# EAGLE design jointio (EAGLE 4.16)
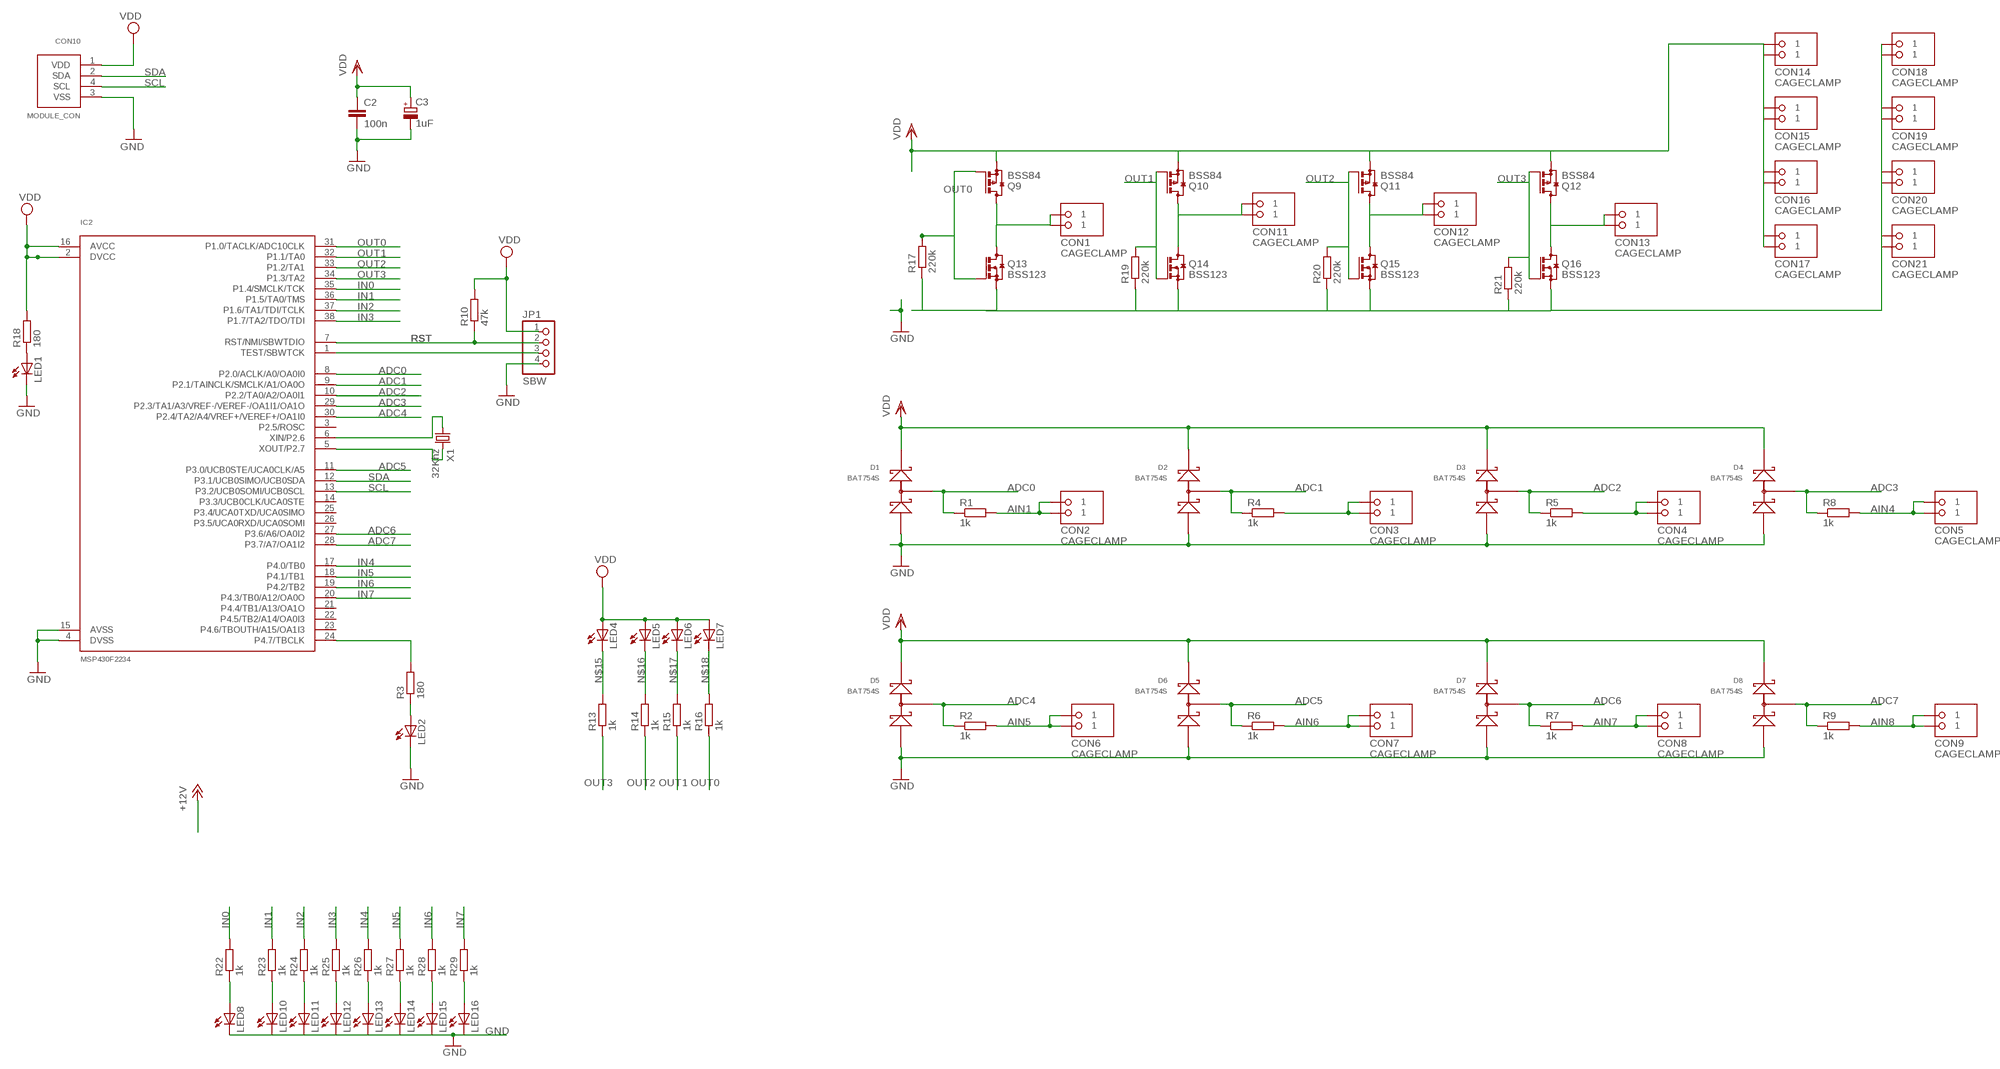
[diagram p0: schematic, sheet 1]

## Parts
C2  100n  C-EUC0603  [C0603]
C3  1uF  CPOL-EUB45181A  [B45181A]
CON1  CAGECLAMP  [CAGECLAMP]
CON2  CAGECLAMP  [CAGECLAMP]
CON3  CAGECLAMP  [CAGECLAMP]
CON4  CAGECLAMP  [CAGECLAMP]
CON5  CAGECLAMP  [CAGECLAMP]
CON6  CAGECLAMP  [CAGECLAMP]
CON7  CAGECLAMP  [CAGECLAMP]
CON8  CAGECLAMP  [CAGECLAMP]
CON9  CAGECLAMP  [CAGECLAMP]
CON10  MODULE_CON  [RJ11-4P4C]
CON11  CAGECLAMP  [CAGECLAMP]
CON12  CAGECLAMP  [CAGECLAMP]
CON13  CAGECLAMP  [CAGECLAMP]
CON14  CAGECLAMP  [CAGECLAMP]
CON15  CAGECLAMP  [CAGECLAMP]
CON16  CAGECLAMP  [CAGECLAMP]
CON17  CAGECLAMP  [CAGECLAMP]
CON18  CAGECLAMP  [CAGECLAMP]
CON19  CAGECLAMP  [CAGECLAMP]
CON20  CAGECLAMP  [CAGECLAMP]
CON21  CAGECLAMP  [CAGECLAMP]
D1  BAT754S  [SOT23]
D2  BAT754S  [SOT23]
D3  BAT754S  [SOT23]
D4  BAT754S  [SOT23]
D5  BAT754S  [SOT23]
D6  BAT754S  [SOT23]
D7  BAT754S  [SOT23]
D8  BAT754S  [SOT23]
IC2  MSP430F2234  [TSSOP38]
JP1  SBW  PINHD-1X4  [1X04]
LED1  LEDCHIP-LED0603  [CHIP-LED0603]
LED2  LEDCHIP-LED0603  [CHIP-LED0603]
LED4  LEDCHIP-LED0603  [CHIP-LED0603]
LED5  LEDCHIP-LED0603  [CHIP-LED0603]
LED6  LEDCHIP-LED0603  [CHIP-LED0603]
LED7  LEDCHIP-LED0603  [CHIP-LED0603]
LED8  LEDCHIP-LED0603  [CHIP-LED0603]
LED10  LEDCHIP-LED0603  [CHIP-LED0603]
LED11  LEDCHIP-LED0603  [CHIP-LED0603]
LED12  LEDCHIP-LED0603  [CHIP-LED0603]
LED13  LEDCHIP-LED0603  [CHIP-LED0603]
LED14  LEDCHIP-LED0603  [CHIP-LED0603]
LED15  LEDCHIP-LED0603  [CHIP-LED0603]
LED16  LEDCHIP-LED0603  [CHIP-LED0603]
Q9  BSS84  [SOT23]
Q10  BSS84  [SOT23]
Q11  BSS84  [SOT23]
Q12  BSS84  [SOT23]
Q13  BSS123  [SOT23]
Q14  BSS123  [SOT23]
Q15  BSS123  [SOT23]
Q16  BSS123  [SOT23]
R1  1k  R-EU_R0603  [R0603]
R2  1k  R-EU_R0603  [R0603]
R3  180  R-EU_R0603  [R0603]
R4  1k  R-EU_R0603  [R0603]
R5  1k  R-EU_R0603  [R0603]
R6  1k  R-EU_R0603  [R0603]
R7  1k  R-EU_R0603  [R0603]
R8  1k  R-EU_R0603  [R0603]
R9  1k  R-EU_R0603  [R0603]
R10  47k  R-EU_R0603  [R0603]
R13  1k  R-EU_R0603  [R0603]
R14  1k  R-EU_R0603  [R0603]
R15  1k  R-EU_R0603  [R0603]
R16  1k  R-EU_R0603  [R0603]
R17  220k  R-EU_R0603  [R0603]
R18  180  R-EU_R0603  [R0603]
R19  220k  R-EU_R0603  [R0603]
R20  220k  R-EU_R0603  [R0603]
R21  220k  R-EU_R0603  [R0603]
R22  1k  R-EU_R0603  [R0603]
R23  1k  R-EU_R0603  [R0603]
R24  1k  R-EU_R0603  [R0603]
R25  1k  R-EU_R0603  [R0603]
R26  1k  R-EU_R0603  [R0603]
R27  1k  R-EU_R0603  [R0603]
R28  1k  R-EU_R0603  [R0603]
R29  1k  R-EU_R0603  [R0603]
X1  32Khz  CRYSTALTC26H  [TC26H]

## Nets
ADC0: D1.3(MID) IC2.8(P2.0/ACLK/A0/OA0I0) R1.1
ADC1: D2.3(MID) IC2.9(P2.1/TAINCLK/SMCLK/A1/OA0O) R4.1
ADC2: D3.3(MID) IC2.10(P2.2/TA0/A2/OA0I1) R5.1
ADC3: D4.3(MID) IC2.29(P2.3/TA1/A3/VREF-/VEREF-/OA1I1/OA1O) R8.1
ADC4: D5.3(MID) IC2.30(P2.4/TA2/A4/VREF+/VEREF+/OA1I0) R2.1
ADC5: D6.3(MID) IC2.11(P3.0/UCB0STE/UCA0CLK/A5) R6.1
ADC6: D7.3(MID) IC2.27(P3.6/A6/OA0I2) R7.1
ADC7: D8.3(MID) IC2.28(P3.7/A7/OA1I2) R9.1
AIN1: CON2.1 CON2.2 R1.2
AIN4: CON5.1 CON5.2 R8.2
AIN5: CON6.1 CON6.2 R2.2
AIN6: CON7.1 CON7.2 R6.2
AIN7: CON8.1 CON8.2 R7.2
AIN8: CON9.1 CON9.2 R9.2
GND: C2.2 C3.- CON10.3(VSS) CON18.1 CON18.2 CON19.1 CON19.2 CON20.1 CON20.2 CON21.1 CON21.2 D1.1(ANODE) D2.1(ANODE) D3.1(ANODE) D4.1(ANODE) D5.1(ANODE) D6.1(ANODE) D7.1(ANODE) D8.1(ANODE) IC2.4(DVSS) IC2.15(AVSS) JP1.4 LED1.C LED2.C LED8.C LED10.C LED11.C LED12.C LED13.C LED14.C LED15.C LED16.C Q13.2(S) Q14.2(S) Q15.2(S) Q16.2(S) R17.1 R19.1 R20.1 R21.1
IN0: IC2.35(P1.4/SMCLK/TCK) R22.2
IN1: IC2.36(P1.5/TA0/TMS) R23.2
IN2: IC2.37(P1.6/TA1/TDI/TCLK) R24.2
IN3: IC2.38(P1.7/TA2/TDO/TDI) R25.2
IN4: IC2.17(P4.0/TB0) R26.2
IN5: IC2.18(P4.1/TB1) R27.2
IN6: IC2.19(P4.2/TB2) R28.2
IN7: IC2.20(P4.3/TB0/A12/OA0O) R29.2
N$1: CON3.1 CON3.2 R4.2
N$2: CON11.1 CON11.2 Q10.3(D) Q14.3(D)
N$3: CON4.1 CON4.2 R5.2
N$4: IC2.6(XIN/P2.6) X1.1
N$5: IC2.24(P4.7/TBCLK) R3.2
N$6: LED1.A R18.1
N$7: CON1.1 CON1.2 Q9.3(D) Q13.3(D)
N$8: LED2.A R3.1
N$9: CON12.1 CON12.2 Q11.3(D) Q15.3(D)
N$10: IC2.1(TEST/SBWTCK) JP1.3
N$12: CON13.1 CON13.2 Q12.3(D) Q16.3(D)
N$15: LED4.C R13.2
N$16: LED5.C R14.2
N$17: LED6.C R15.2
N$18: LED7.C R16.2
N$19: IC2.5(XOUT/P2.7) X1.2
N$21: LED8.A R22.1
N$22: LED10.A R23.1
N$23: LED11.A R24.1
N$24: LED12.A R25.1
N$25: LED13.A R26.1
N$26: LED14.A R27.1
N$27: LED15.A R28.1
N$28: LED16.A R29.1
OUT0: IC2.31(P1.0/TACLK/ADC10CLK) Q9.1(G) Q13.1(G) R16.1 R17.2
OUT1: IC2.32(P1.1/TA0) Q10.1(G) Q14.1(G) R15.1 R19.2
OUT2: IC2.33(P1.2/TA1) Q11.1(G) Q15.1(G) R14.1 R20.2
OUT3: IC2.34(P1.3/TA2) Q12.1(G) Q16.1(G) R13.1 R21.2
RST: IC2.7(RST/NMI/SBWTDIO) JP1.2 R10.1
SCL: CON10.4(SCL) IC2.13(P3.2/UCB0SOMI/UCB0SCL)
SDA: CON10.2(SDA) IC2.12(P3.1/UCB0SIMO/UCB0SDA)
VDD: C2.1 C3.+ CON10.1(VDD) CON14.1 CON14.2 CON15.1 CON15.2 CON16.1 CON16.2 CON17.1 CON17.2 D1.2(CATHODE) D2.2(CATHODE) D3.2(CATHODE) D4.2(CATHODE) D5.2(CATHODE) D6.2(CATHODE) D7.2(CATHODE) D8.2(CATHODE) IC2.2(DVCC) IC2.16(AVCC) JP1.1 LED4.A LED5.A LED6.A LED7.A Q9.2(S) Q10.2(S) Q11.2(S) Q12.2(S) R10.2 R18.2
Unconnected: IC2.3(P2.5/ROSC) IC2.14(P3.3/UCB0CLK/UCA0STE) IC2.21(P4.4/TB1/A13/OA1O) IC2.22(P4.5/TB2/A14/OA0I3) IC2.23(P4.6/TBOUTH/A15/OA1I3) IC2.25(P3.4/UCA0TXD/UCA0SIMO) IC2.26(P3.5/UCA0RXD/UCA0SOMI)

## Library data of the parts
C2 = rcl:C-EU: CAPACITOR, European symbol
C3 = rcl:CPOL-EU: POLARIZED CAPACITOR, European symbol
CON1-CON9 CON11-CON21 = ecssr:CAGECLAMP
CON10 = ecssr:MODULE_CON
D1-D8 = ecssr:BAT754S
IC2 = ecssr:MSP430F2234
JP1 = pinhead:PINHD-1X4: PIN HEADER
LED1 LED2 LED4-LED8 LED10-LED16 = led:LED: LED OSRAM: - CHIPLED LG R971, LG N971, LY N971, LG Q971, LY Q971, LO R971, LY R971 LH N974, LH R974 LS Q976, LO Q976, LY Q976 LO Q996 - Hyper CHIPLED LW Q18S LB Q993, LB Q99A, LB R99A - SideLED LS A670, LO A670, LY A670, LG A670, LP A670 LB A673, LV A673, LT A673, LW A673 LH A674 LY A675 LS A676, LA A676, LO A676, LY A676, LW A676 LS A679, LY A679, LG A679 - Hyper Micro SIDELED® LS Y876, LA Y876, LO Y876, LY Y876 LT Y87S - SmartLED LW L88C, LW L88S LB L89C, LB L89S, LG L890 LS L89K, LO L89K, LY L89K LS L896, LA L896, LO L896, LY L896 - TOPLED LS T670, LO T670, LY T670, LG T670, LP T670 LSG T670, LSP T670, LSY T670, LOP T670, LYG T670 LG T671, LOG T671, LSG T671 LB T673, LV T673, LT T673, LW T673 LH T674 LS T676, LA T676, LO T676, LY T676, LB T676, LH T676, LSB T676, LW T676 LB T67C, LV T67C, LT T67C, LS T67K, LO T67K, LY T67K, LW E67C LS E67B, LA E67B, LO E67B, LY E67B, LB E67C, LV E67C, LT E67C LW T67C LS T679, LY T679, LG T679 LS T770, LO T770, LY T770, LG T770, LP T770 LB T773, LV T773, LT T773, LW T773 LH T774 LS E675, LA E675, LY E675, LS T675 LS T776, LA T776, LO T776, LY T776, LB T776 LHGB T686 LT T68C, LB T68C - Hyper Mini TOPLED® LB M676 - Mini TOPLED Santana® LG M470 LS M47K, LO M47K, LY M47K Source: http://www.osram.convergy.de - LUMILED® LXK2-PW12-R00, LXK2-PW12-S00, LXK2-PW14-U00, LXK2-PW14-V00 LXK2-PM12-R00, LXK2-PM12-S00, LXK2-PM14-U00 LXK2-PE12-Q00, LXK2-PE12-R00, LXK2-PE12-S00, LXK2-PE14-T00, LXK2-PE14-U00 LXK2-PB12-K00, LXK2-PB12-L00, LXK2-PB12-M00, LXK2-PB14-N00, LXK2-PB14-P00, LXK2-PB14-Q00 LXK2-PR12-L00, LXK2-PR12-M00, LXK2-PR14-Q00, LXK2-PR14-R00 LXK2-PD12-Q00, LXK2-PD12-R00, LXK2-PD12-S00 LXK2-PH12-R00, LXK2-PH12-S00 LXK2-PL12-P00, LXK2-PL12-Q00, LXK2-PL12-R00 Source: www.luxeon.com
Q9-Q12 = transistor-small-signal:BSS84: P-CHANNEL MOS FET
Q13-Q16 = transistor-small-signal:BSS123: N-CHANNEL MOS FET
R1-R10 R13-R29 = rcl:R-EU_: RESISTOR, European symbol
X1 = crystal:CRYSTAL: CRYSTAL

## Board
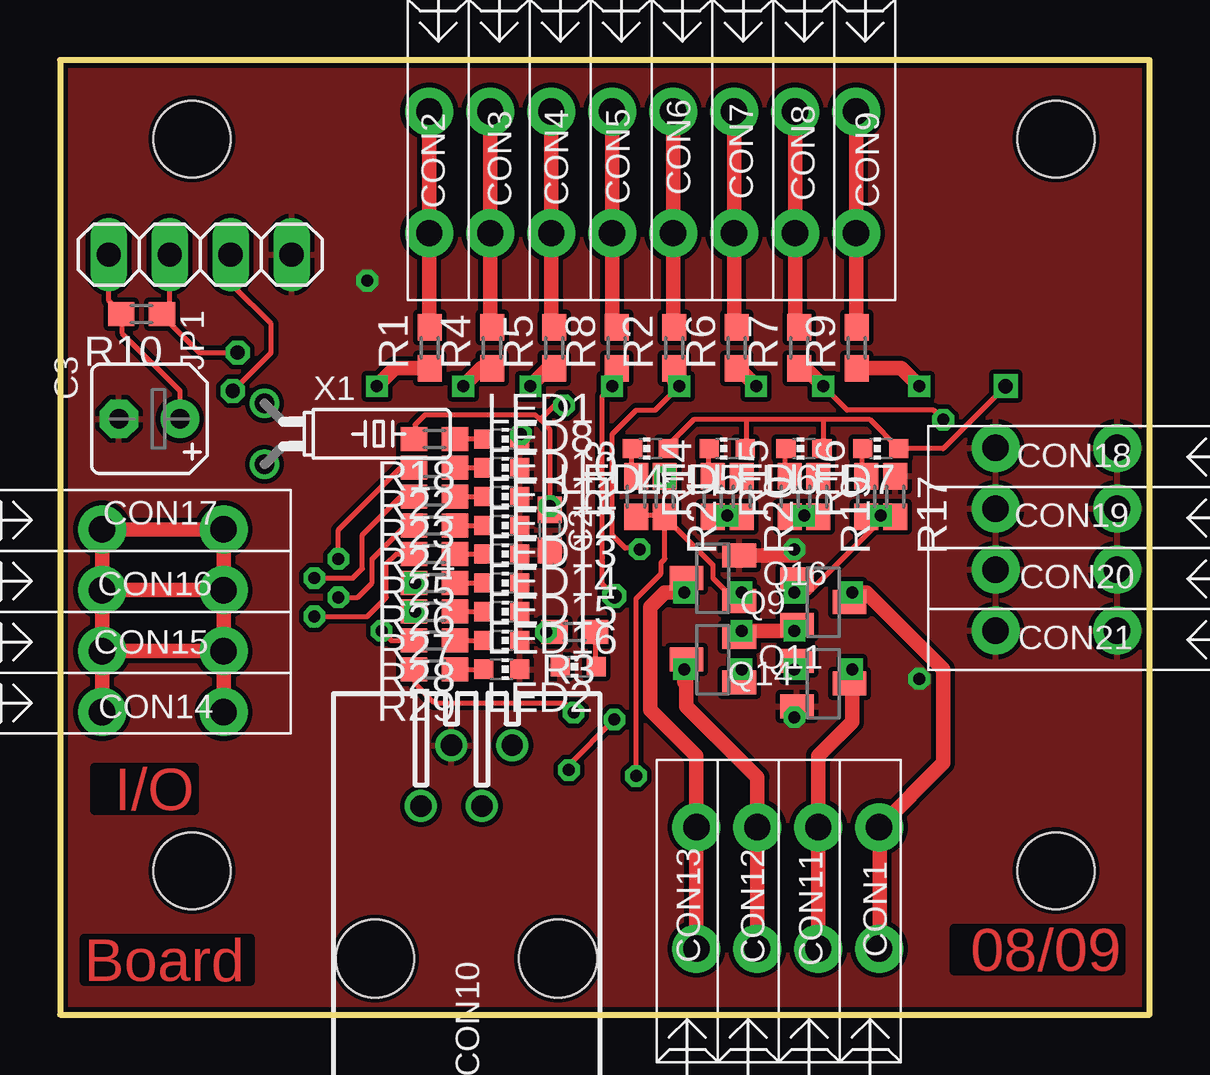
[diagram p1: board, top side]
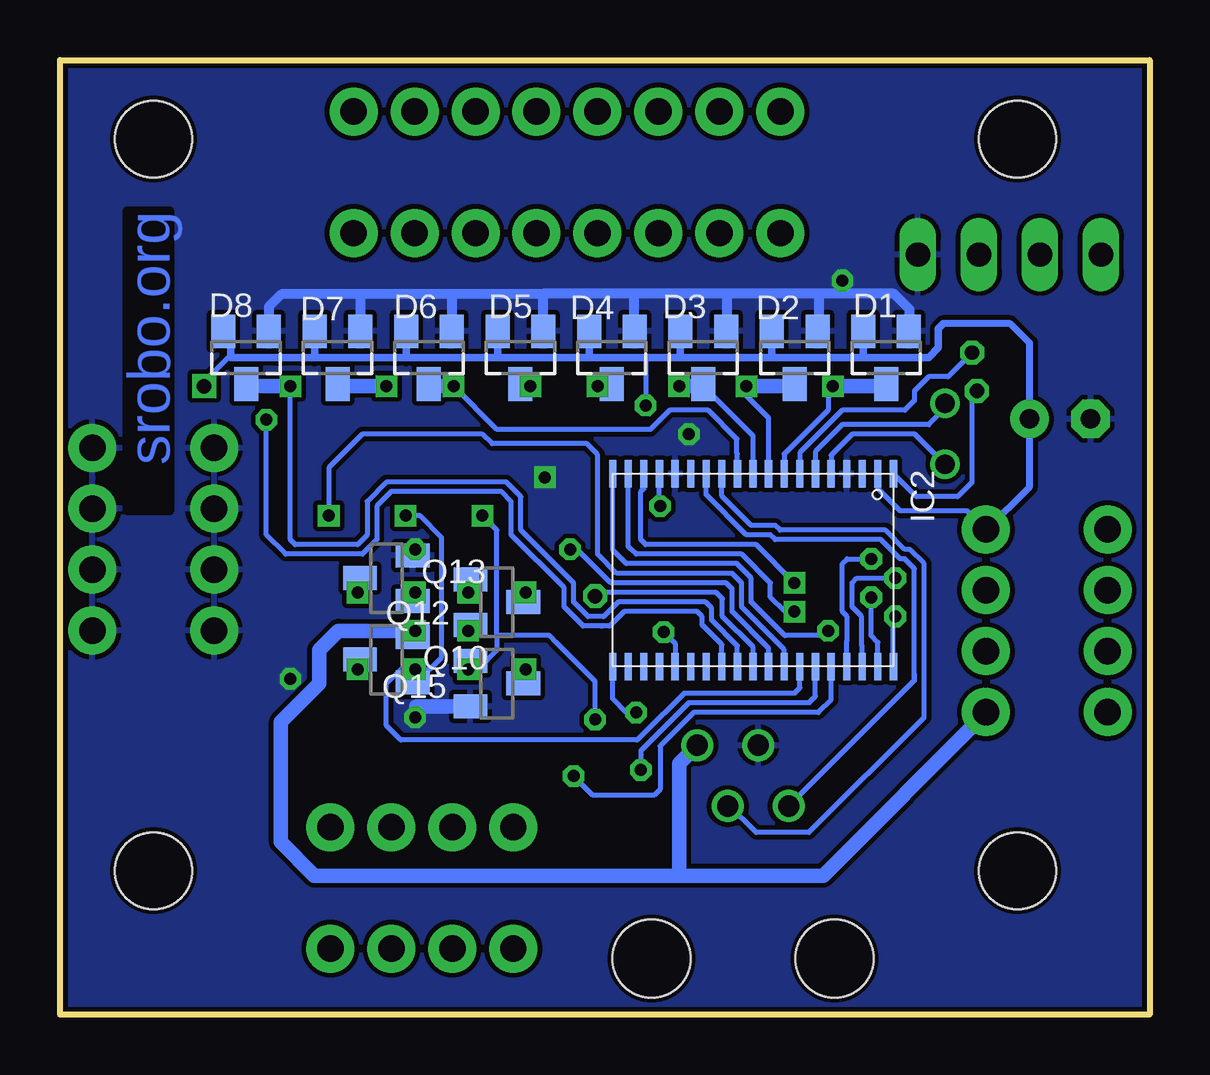
[diagram p2: board, bottom side, seen from below]

Size 45.4 x 39.8 mm. Coordinates in mm from the lower left corner, seen from the top.
Outline: 0,0 45.4,0 45.4,39.8 0,39.8 0,0
Copper layers (1*16): Top 0.035mm / dielectric 1.5mm / Bottom 0.035mm
Design rules "default": minimum track width 0.2mm, minimum drill 0.5mm, track to track 0.2mm, track to pad 0.2mm, pad to pad 0.2mm, via to via 0.2mm, smd to smd 0mil, copper to edge 0.2mm, drill to drill 0.2mm, minimum pad ring 0.2mm, minimum via ring 0.2mm, stop-mask expansion 0mil, vias tented up to drill 0mil, thermal gap 0.2mm
Holes 3.2 mm at 5.5,6 5.5,36.5 41.5,36.5 41.5,6
tRestrict: area 68.8,25.4 to 74.9,31.4; area 68.7,1.7 to 74.9,7.9; area 15.3,13.7 to 15.9,13.8; area 18.1,13.8 to 18.7,13.9; area 18.8,13.2 to 18.9,13.8; area 18.2,13.9 to 18.6,24.7
bRestrict: area 68.7,25.3 to 74.9,31.5; area 68.6,1.6 to 74.9,7.9

### Footprints (pad centres in the part's own frame; a part is rotated, then mirrored left to right if it is on the bottom)
C0603 = smd 1.1 x 1: 1 -0.85,0; 2 0.85,0
B45181A = drill 0.813 pad 1.6 round: + -1.27,0 | drill 0.813 pad 1.6 octagon: - 1.27,0
CAGECLAMP = drill 1.1 pad 2 round: 1 0,-0.01; 2 0,-5.08
RJ11-4P4C = drill 0.889 round: 1 1.905,8.89; 2 0.635,6.35; 3 -0.635,8.89; 4 -1.905,6.35 | hole 3.251: -3.81,0; 3.81,0
SOT23 = smd 1 x 1.4: 1 -0.95,-1.1; 2 0.95,-1.1; 3 0,1.1
TSSOP38 = smd 1.15 x 0.3: 1 0,0; 2 0,-0.65; 3 0,-1.3; 4 0,-1.95; 5 0,-2.6; 6 0,-3.25; 7 0,-3.9; 8 0,-4.55; 9 0,-5.2; 10 0,-5.85; 11 0,-6.5; 12 0,-7.15; 13 0,-7.8; 14 0,-8.45; 15 0,-9.1; 16 0,-9.75; 17 0,-10.4; 18 0,-11.05; 19 0,-11.7; 20 8.05,-11.7; 21 8.05,-11.05; 22 8.05,-10.4; 23 8.05,-9.75; 24 8.05,-9.1; 25 8.05,-8.45; 26 8.05,-7.8; 27 8.05,-7.15; 28 8.05,-6.5; 29 8.05,-5.85; 30 8.05,-5.2; 31 8.05,-4.55; 32 8.05,-3.9; 33 8.05,-3.25; 34 8.05,-2.6; 35 8.05,-1.95; 36 8.05,-1.3; 37 8.05,-0.65; 38 8.05,0
1X04 = drill 1.016 long: 1 -3.81,0; 2 -1.27,0; 3 1.27,0; 4 3.81,0
CHIP-LED0603 = smd 0.8 x 0.8: A 0,-0.75; C 0,0.75
R0603 = smd 1.1 x 1: 1 -0.85,0; 2 0.85,0
TC26H = drill 0.813 round: 1 -1.27,0; 2 1.27,0

### Placement (x,y rotation side)
C2  20.4,20.2 270 top
C3  3.73,24.84 180 top
CON1  34.13,2.74 180 top
CON2  15.39,37.66 0 top
CON3  17.93,37.66 0 top
CON4  20.47,37.66 0 top
CON5  23.01,37.66 0 top
CON6  25.55,37.66 0 top
CON7  28.09,37.66 0 top
CON8  30.63,37.66 0 top
CON9  33.17,37.66 0 top
CON10  16.94,2.35 0 top
CON11  31.59,2.74 180 top
CON12  29.05,2.74 180 top
CON13  26.51,2.74 180 top
CON14  1.74,12.62 90 top
CON15  1.74,15.16 90 top
CON16  1.74,17.7 90 top
CON17  1.74,20.24 90 top
CON18  44.06,23.63 270 top
CON19  44.06,21.09 270 top
CON20  44.06,18.55 270 top
CON21  44.06,16.01 270 top
D1  10.98,27.39 180 bottom
D2  14.79,27.39 180 bottom
D3  18.6,27.39 180 bottom
D4  22.41,27.39 180 bottom
D5  26.22,27.39 180 bottom
D6  30.03,27.39 180 bottom
D7  33.84,27.39 180 bottom
D8  37.65,27.39 180 bottom
IC2  10.68,22.56 270 bottom
JP1  5.84,31.69 0 top
LED1  18.4,24 270 top
LED2  21.59,14.51 90 top
LED4  24.6,23.6 90 top
LED5  27.8,23.6 90 top
LED6  31,23.6 90 top
LED7  34.2,23.6 90 top
LED8  18.4,22.8 270 top
LED10  18.4,21.6 270 top
LED11  18.4,20.4 270 top
LED12  18.4,19.2 270 top
LED13  18.4,18 270 top
LED14  18.4,16.8 270 top
LED15  18.4,15.6 270 top
LED16  18.4,14.4 270 top
Q9  31.8,17.2 270 top
Q10  31.8,14.8 90 bottom
Q11  27.2,14.8 90 top
Q12  27.2,17.2 270 bottom
Q13  31.8,18.2 90 bottom
Q14  31.8,13.8 270 top
Q15  27.2,13.8 270 bottom
Q16  27.2,18.2 90 top
R1  15.4,27.8 90 top
R2  25.6,27.8 90 top
R3  21.45,15.95 180 top
R4  18,27.8 90 top
R5  20.6,27.8 90 top
R6  28.2,27.8 90 top
R7  30.8,27.8 90 top
R8  23.2,27.8 90 top
R9  33.2,27.8 90 top
R10  3.4,29.2 180 top
R13  24,21.6 90 top
R14  27.2,21.6 90 top
R15  30.4,21.6 90 top
R16  33.6,21.6 90 top
R17  34.8,21.6 270 top
R18  15.6,24 180 top
R19  31.6,21.6 270 top
R20  28.4,21.6 270 top
R21  25.2,21.6 270 top
R22  15.6,22.8 180 top
R23  15.6,21.6 180 top
R24  15.6,20.4 180 top
R25  15.6,19.2 180 top
R26  15.6,18 180 top
R27  15.6,16.8 180 top
R28  15.6,15.6 180 top
R29  15.6,14.4 180 top
X1  8.52,24.21 270 top

### Tracks (layer width: path | path; a pad name or v marks a point on that pad's centre or on a via)
ADC0  (via drill 0.5)
  Top 0.6: R1.1 13.95,26.95 v13.2,26.2
  Bottom 0.2: IC2.8 15.22,23.38 13.4,25.2 13.4,26 v13.2,26.2
  Bottom 0.6: D1.3 10.98,26.38 11,26.4 11.2,26.2 v13.2,26.2
ADC1  (via drill 0.5)
  Top 0.6: R4.1 17.55,26.95 v16.8,26.2
  Bottom 0.2: v16.8,26.2 16.8,25.8 15.88,24.88 IC2.9
  Bottom 0.305: 14.76,26.43 14.76,26.32 D2.3
  Bottom 0.6: D2.3 14.79,26.21 14.8,26.2 v16.8,26.2
ADC2  (via drill 0.5)
  Top 0.6: R5.1 20.35,26.95 v19.6,26.2
  Bottom 0.2: IC2.10 16.52,24.12 18.6,26.2
  Bottom 0.305: 18.62,26.27 18.61,26.27 D3.3
  Bottom 0.406: D3.3 18.6,26.07 18.62,26.05 18.6,26.02
  Bottom 0.6: D3.3 18.6,26.2 v19.6,26.2
ADC3  (via drill 0.5, 0.6 pad 0.9)
  Top 0.2: 22.6,18.9 22.6,19.1 | 22.6,18.9 22.6,18.8 | 22.6,19.1 22.6,25.8 v23,26.2 | 22.6,19.1 22.6,19 | v23.1,17.45 22.6,17.95 22.6,18.9
  Top 0.6: R8.1 23.2,26.6 v23,26.2
  Bottom 0.2: IC2.29 16.52,15.32 17.8,16.6 17.8,17.35 18.05,17.6 22.95,17.6 v23.1,17.45
  Bottom 0.6: D4.3 22.41,26.39 22.4,26.4 v23,26.2
ADC4  (via drill 0.5)
  Top 0.2: v25.8,26.2 24.8,25.2 24,25.2 23,24.2 23,20 23.55,19.45 24.25,19.45 24.3,19.4 v24.15,19.4
  Top 0.6: R2.1 25.6,26.4 v25.8,26.2
  Bottom 0.2: IC2.30 15.88,15.28 17.4,16.8 17.4,17.75 17.65,18 22.45,18 23.85,19.4 v24.15,19.4 24.15,19.45
  Bottom 0.6: D5.3 26.22,26.38 26.2,26.4 26,26.2 v25.8,26.2
ADC5  (via drill 0.5)
  Top 0.6: R6.1 28.25,26.95 v29,26.2
  Bottom 0.2: IC2.11 17.18,23.38 17.2,23.4 17.2,24 18.4,25.2 20,25.2 20.8,24.4 27.2,24.4 v29,26.2
  Bottom 0.6: D6.3 30.03,26.23 30,26.2 v29,26.2
ADC6  (via drill 0.5)
  Top 0.2: v31.8,26.2 32.8,25.2 36.4,25.2 v36.8,24.8
  Top 0.6: R7.1 31.05,26.95 v31.8,26.2
  Bottom 0.2: IC2.27 17.82,15.43 18.65,16.25 18.65,16.6 18.85,16.8 21.9,16.8 22.5,16.2 22.85,16.2 | 22.85,16.2 23.6,16.2 24.4,17 24.4,17.8 26.6,20 26.6,21.4 27,21.8 31.6,21.8 32.2,21.2 32.2,19.8 32.8,19.2 36,19.2 36.8,20 v36.8,24.8 | 22.85,16.2 22.8,16.2
  Bottom 0.6: D7.3 33.84,26.24 33.8,26.2 v31.8,26.2
ADC7  (via drill 0.5)
  Top 0.6: R9.1 35.05,26.95 v35.8,26.2
  Bottom 0.2: IC2.28 17.18,15.38 18.25,16.45 18.25,16.95 18.5,17.2 22.15,17.2 22.75,16.6 23.4,16.6 24,17.2 24,18 26.2,20.2 26.2,21.6 26.8,22.2 31.8,22.2 32.6,21.4 32.6,20 33,19.6 35.6,19.6 35.8,19.8 v35.8,26.2
  Bottom 0.6: D8.3 37.65,26.25 37.6,26.2 v35.8,26.2
AIN1
  Top 0.6: R1.2 15.4,28.6 15.39,28.61 CON2.2
  Top 0.61: CON2.2 CON2.1
AIN4
  Top 0.6: R8.2 23.2,28.6 23.01,28.79 CON5.2
  Top 0.61: CON5.2 CON5.1
AIN5
  Top 0.6: R2.2 25.6,28.6 25.55,28.65 CON6.2
  Top 0.61: CON6.2 CON6.1
AIN6
  Top 0.6: R6.2 28.2,28.6 28.09,28.71 CON7.2
  Top 0.61: 28.09,37.69 CON7.1 | CON7.2 28.09,37.69 | 28.09,37.69 28.06,37.71
AIN7
  Top 0.6: R7.2 30.8,28.6 30.63,28.77 CON8.2
  Top 0.61: CON8.2 CON8.1
AIN8
  Top 0.6: R9.2 33.2,28.6 33.17,28.63 CON9.2
  Top 0.61: CON9.2 CON9.1
GND  (via drill 0.5)
  Top 0.2: R21.1 v25.2,22.4 | 28.4,22.4 R20.1 28.4,22.6 | LED1.C 19.15,24.15 v19.2,24.2
  Top 0.6: Q16.2 30.55,19.15 v30.6,19.4 | 30.7,12.9 30.8,13 | 30.7,12.9 Q14.2 | v30.6,12.4 30.7,12.9
  Bottom 0.2: v19.2,24.2 19.2,24
  Bottom 0.305: 25.27,30.06 D5.1 | 21.49,28.48 D4.1 | 17.66,28.46 D3.1 17.65,28.51 17.64,28.52 17.92,28.8
  Bottom 0.406: D8.1 36.7,29.51 36.17,30.03 32.9,30.03 | 29.11,30.03 25.25,30.03 25.27,30.02 D5.1 | 29.11,30.03 32.9,30.03 | D7.1 32.89,30.02 32.9,30.03 | D6.1 29.08,30 29.11,30.03 | 13.79,30.06 10.66,30.06 10,29.4 10,28.6 10.03,28.57 D1.1 | 13.79,30.06 17.61,30.06 | 17.61,30.06 21.5,30.06 | 21.5,30.06 25.27,30.06 | D2.1 13.84,28.44 13.8,28.4 13.79,28.41 13.79,30.06 | D3.1 17.65,28.55 17.6,28.6 17.61,28.61 17.61,30.06 | D4.1 21.49,28.49 21.6,28.6 21.5,28.7 21.5,30.06
  Bottom 0.6: Q13.2 30.75,19.15 30.8,19.2 v30.6,19.4 | Q15.2 30.55,12.85 v30.6,12.4
  other vias: 12.8,30.6 35.8,14
  pour Top (isolate 0.2): -1.6,-3.4 47.2,-3.2 47.2,40.4 -1.6,40.4
  pour Bottom (isolate 0.2): -2.4,-2 46.4,-2 46.4,41 -2.4,41
IN0  (via drill 0.5)
  Top 0.2: 14.8,22.8 R22.2 14.2,22.8 11.6,20.2 v11.6,19
  Bottom 0.2: IC2.35 12.62,15.57 12.6,15.6 12.6,16.6 12.8,16.8 12.8,18.8 12.6,19 v11.6,19
IN1  (via drill 0.5)
  Top 0.2: R23.2 14.75,21.55 | R23.2 14.8,21.6 | R23.2 14.2,21.6 12.6,20 12.6,18.6 12.2,18.2 v10.6,18.2
  Bottom 0.2: IC2.36 11.97,15.38 12,15.4 12,16.6 12.4,17 12.4,18 12.2,18.2 v10.6,18.2
IN2  (via drill 0.5)
  Top 0.2: R24.2 14.4,20.4 13,19 13,18 12.4,17.4 v11.6,17.4
  Bottom 0.2: IC2.37 11.32,15.53 11.6,15.8 v11.6,17.4
IN3  (via drill 0.5)
  Top 0.2: R25.2 14,19.2 13.6,18.8 13.6,17.4 12.8,16.6 v10.6,16.6
  Bottom 0.2: IC2.38 10.68,16.52 v10.6,16.6
IN4  (via drill 0.5)
  Top 0.2: 14.6,18 R26.2 v14.8,18
  Bottom 0.2: v14.8,18 16.4,19.6 21,19.6 21.2,19.8 21.2,21.8 21.07,21.93 IC2.17
IN5  (via drill 0.5)
  Top 0.2: 14.6,16.8 R27.2 v14.8,16.8
  Bottom 0.2: v14.8,16.8 15.2,16.8 15.8,17.4 15.8,18 17,19.2 21.4,19.2 21.6,19.4 21.73,19.52 IC2.18
IN6  (via drill 0.5)
  Top 0.2: 14.6,15.6 R28.2 13.8,15.6 v13.4,16
  Bottom 0.2: IC2.19 22.38,19.38 21.8,18.8 17.2,18.8 16.6,18.2 16.6,17.2 15.2,15.8 13.6,15.8 v13.4,16
IN7  (via drill 0.5)
  Top 0.2: R29.2 14.8,14.4 14.8,13.8 15.6,13 21,13 v21.4,12.6
  Bottom 0.2: IC2.20 22.38,13.18 21.8,12.6 v21.4,12.6
N$1
  Top 0.6: R4.2 18,28.6 17.93,28.67 CON3.2
  Top 0.61: CON3.2 CON3.1
N$2  (via drill 0.5)
  Top 0.2: Q14.3 33,13.8 v33,14.4
  Top 0.6: v33,14.4 33,12.2 31.59,10.79 CON11.2 CON11.1
  Bottom 0.2: Q10.3 33,14.7 v33,14.4
N$3
  Top 0.6: R5.2 20.6,28.6 20.47,28.73 CON4.2
  Top 0.61: CON4.2 CON4.1
N$4
  Bottom 0.2: IC2.6 13.93,23.48 12.8,24.6 9.2,24.6 8.4,25.4 8.48,25.48 X1.1
N$5  (via drill 0.5 pad 0.9)
  Top 0.2: 20.75,16 R3.2 v20.25,15.95
  Bottom 0.2: IC2.24 19.77,15.47 v20.25,15.95
N$6
  Top 0.2: 16.4,24 R18.1 LED1.A
N$7  (via drill 0.5)
  Top 0.2: Q9.3 32.8,17.2 32.8,17.4 v33,17.6
  Top 0.6: v33,17.6 33.6,17.6 36.8,14.4 36.8,10.49 CON1.2 34.15,7.8 34.15,2.77 CON1.1
  Top 0.61: CON1.1
  Bottom 0.2: Q13.3 33,18.1 v33,17.6
N$8
  Top 0.2: LED2.A 22.4,14.45 22.3,14.45 R3.1
N$9  (via drill 0.5)
  Top 0.2: Q11.3 26.2,14.8 26.2,14.6 v26,14.4
  Top 0.6: 26,13.87 v26,14.4 26,14.45 26.1,14.35 26.1,12.85 29.05,9.9 CON12.2 CON12.1
  Bottom 0.2: Q15.3 26,13.9 v26,14.4
N$10  (via drill 0.6)
  Top 0.2: v7.2,26 8.8,27.6 8.8,28.8 7.2,30.4 7.2,31.77 | 7.2,31.77 7.2,31.8 | 7.2,31.77 JP1.3
  Bottom 0.2: IC2.1 9.72,21.6 8,21.6 7.4,22.2 7.4,25.8 v7.2,26
N$12  (via drill 0.5)
  Top 0.2: Q16.3 26.2,18.2 26.2,18 v26,17.6
  Top 0.6: CON13.1 CON13.2 26.51,10.79 24.6,12.7 24.6,17 25.2,17.6 v26,17.6
  Bottom 0.2: Q12.3 26,17.3 v26,17.6
N$15
  Top 0.2: LED4.C 23.8,23.6 23.8,22.65 R13.2
N$16
  Top 0.2: LED5.C 27,23.6 27,22.65 R14.2
N$17
  Top 0.2: LED6.C 30.2,23.6 30.2,22.65 R15.2
N$18
  Top 0.2: LED7.C 33.4,23.6 33.4,22.65 R16.2
N$19
  Bottom 0.2: X1.2 9.78,24.2 12.4,24.2 13.28,23.32 IC2.5
N$21
  Top 0.2: R22.1 LED8.A
N$22
  Top 0.2: 16.4,21.6 R23.1 LED10.A
N$23
  Top 0.2: R24.1 LED11.A
N$24
  Top 0.2: 16.4,19.2 R25.1 LED12.A
N$25
  Top 0.2: R26.1 LED13.A
N$26
  Top 0.2: R27.1 LED14.A
N$27
  Top 0.2: R28.1 LED15.A
N$28
  Top 0.2: 16.4,14.4 R29.1 LED16.A
OUT0  (via drill 0.5)
  Top 0.2: Q9.1 30.75,18.2 30.8,18.2 v30.6,17.6 31.2,17.6 34.2,20.6 v34.2,20.8 | R17.2 34.75,20.8 v34.2,20.8 | 33.8,20.8 33.6,20.8 R16.1 33.75,20.75 33.8,20.8 | v34.2,20.8 33.8,20.8
  Bottom 0.2: Q13.1 30.8,17.35 v30.6,17.6 | IC2.31 15.22,15.22 17,17 17,18 17.4,18.4 22.2,18.4 23,19.2 23,23.35 23.45,23.8 27.4,23.8 27.8,24.2 32.8,24.2 34.2,22.8 v34.2,20.8
OUT1  (via drill 0.5)
  Top 0.2: Q14.1 30.75,14.8 30.8,14.8 30.8,14.6 v30.6,14.4 | R19.2 31.55,20.8 v31,20.8 | v31,20.8 30.4,20.8 R15.1 30.45,20.8 v31,20.8
  Bottom 0.2: Q10.1 30.6,13.95 v30.6,14.4 | v30.6,14.4 31,14.4 | IC2.32 14.57,13.62 14.8,13.4 19.4,13.4 21.1,11.7 21.35,11.45 31.2,11.45 31.8,12.05 31.8,13.8 31.2,14.4 v30.6,14.4 | v31,20.8 30.4,20.8 29.5,19.9 29.5,14.9 30,14.4 v30.6,14.4
OUT2  (via drill 0.5)
  Top 0.2: Q11.1 28.4,13.95 v28.4,14.4 | R14.1 27.2,20.8 v27.8,20.8 28.35,20.8 R20.2 | 21.4,10.2 v21.2,10.2 21.2,10.4 v23.1,12.3
  Bottom 0.2: Q15.1 28.25,14.8 28.2,14.8 28.2,14.6 v28.4,14.4 28,14.4 27.2,15.2 27.2,15.8 | v27.8,20.8 27.2,20.2 27.2,15.8 | IC2.33 13.93,13.28 14.2,13 19.2,13 21.2,11 v21.2,10.2 | 24.7,15.5 25,15.8 27.2,15.8 | 24.7,15.5 24.6,15.4 | 24.7,15.5 23.1,13.9 v23.1,12.3
OUT3  (via drill 0.5)
  Top 0.2: Q16.1 28.4,17.35 v28.4,17.6 27.8,17.6 27.2,18.2 27.2,18.75 R21.2 | R21.2 25.15,20.8 24,20.8 R13.1 | R21.2 25.15,20.7 25.2,20.65 25.2,19 25.05,18.85 25.05,18.4 24,17.35 v24,9.95
  Bottom 0.2: Q12.1 28.35,18.2 28.4,18.2 v28.4,17.6 | IC2.34 13.28,13.12 13.8,12.6 19,12.6 20.4,11.2 20.4,9.4 20.65,9.15 23.2,9.15 23.95,9.9 24,9.9 v24,9.95
RST  (via drill 0.6)
  Top 0.2: JP1.2 4.57,29.37 4.4,29.2 R10.1 4.2,29.2 5.8,27.6 v7.4,27.6
  Bottom 0.2: IC2.7 14.57,23.43 12.8,25.2 10.2,25.2 9.8,25.6 9.8,26 9.2,26.6 8.4,26.6 v7.4,27.6
SCL
  Bottom 0.2: IC2.13 18.48,21.68 16.8,20 15.8,20 15.6,19.8 11.2,19.8 10.4,19 10.2,19 9.8,18.6 9.8,14.2 | 9.8,14.2 9.8,14 | CON10.4 9.8,13.93 9.8,14.2
SDA
  Bottom 0.2: IC2.12 17.82,21.62 16.6,20.4 15.6,20.4 15.4,20.2 11,20.2 10.2,19.4 10,19.4 9.4,18.8 9.4,12.4 14.2,7.6 16.4,7.6 17.58,8.78 | 17.58,8.78 17.6,8.8 | 17.58,8.78 CON10.2
VDD  (via drill 0.5, 0.6)
  Top 0.2: Q11.2 28.4,15.85 v28.4,16 | Q9.2 30.8,16.15 v30.6,16 | LED6.A 31.8,23.65 31.8,24.8 | LED5.A 28.6,23.65 28.6,24.8 | C2.1 20.34,21.14 v20.4,21.2 20.4,24.4 20,24.8 | 31.8,24.8 28.6,24.8 | 31.8,24.8 33.75,24.8 LED7.A 36.8,23.6 v39.4,26.2 | LED4.A 25.2,23.6 26.4,24.8 28.6,24.8 | R18.2 14.8,24.05 14.8,24.6 15.2,25 19.8,25 20,24.8 | JP1.1 2.03,29.77 2.6,29.2 | 2.6,29.2 R10.2 | 2.6,29.2 2.6,28.4 5,26 C3.+ | C3.+ 5,24.8 | C3.+ | 20,24.8 20.6,25.4 v21,25.4
  Top 0.6: v30.6,16 v28.4,16
  Top 0.61: CON16.1 1.75,20.23 CON17.1 | CON15.1 CON16.1 | CON14.1 CON15.1 | CON15.2 CON14.2 | CON15.2 CON16.2 | CON16.2 CON17.2 | CON17.1 | CON17.1 CON17.2 | CON16.1 | CON16.1 CON16.2 | CON15.1 | CON15.1 CON15.2 | CON17.2 6.82,20.44
  Bottom 0.2: Q12.2 28.35,16.2 28.4,16.2 v28.4,16 | Q10.2 30.75,15.8 30.8,15.8 v30.6,16 | IC2.16 20.43,21.43 v20.4,21.2 | IC2.2 11.32,21.93 10.4,21 7.6,21 6.8,20.2 | 38.28,27.39 38.39,27.39 38.4,27.4 39.4,26.4 v39.4,26.2 | 21,27.4 21,27.39 v21,25.4
  Bottom 0.3: 6.8,20.2 6.8,20.22 CON17.2 6.82,20.22 6.8,20.2 | 8.6,28.8 5.8,28.8 5,28 5,24.8 | 5,24.8 C3.+ | 5,24.8 5,22 6.8,20.2
  Bottom 0.305: 11.93,27.39 D1.2 | 11.93,27.39 15.42,27.39 | 15.42,27.39 19.87,27.39 | 19.87,27.39 21,27.39 23.04,27.39 | 23.04,27.39 26.85,27.39 | 26.85,27.39 30.66,27.39 | 30.66,27.39 34.47,27.39 | 34.47,27.39 38.28,27.39 38.28,28.66 38.6,28.66 D8.2 | D2.2 15.74,27.39 15.42,27.39 | 19.87,27.39 19.55,27.39 D3.2 19.55,28.57 19.56,28.59 | D4.2 23.36,27.39 23.04,27.39 | D6.2 30.98,27.39 30.66,27.39 | D5.2 27.17,27.39 26.85,27.39 | D7.2 34.79,27.39 34.47,27.39 | 11.93,27.39 9.21,27.39 8.8,27.8 8.8,28.6 8.6,28.8
  Bottom 0.6: v30.6,16 33.8,16 34.6,15.2 34.6,13.8 36.2,12.2 36.2,10.2 | CON14.2 6.8,12.6 13.6,5.8 19.6,5.8 | CON10.1 19.6,10.48 19.6,5.8 | 36.2,10.2 36.2,9.8 | 19.6,5.8 34.8,5.8 36.2,7.2 36.2,10.2

### Text on the board
Top: I/O | 08/09 | Board
Bottom: srobo.org